# EAGLE design Injector_1.0v_making (EAGLE 6.5.0)
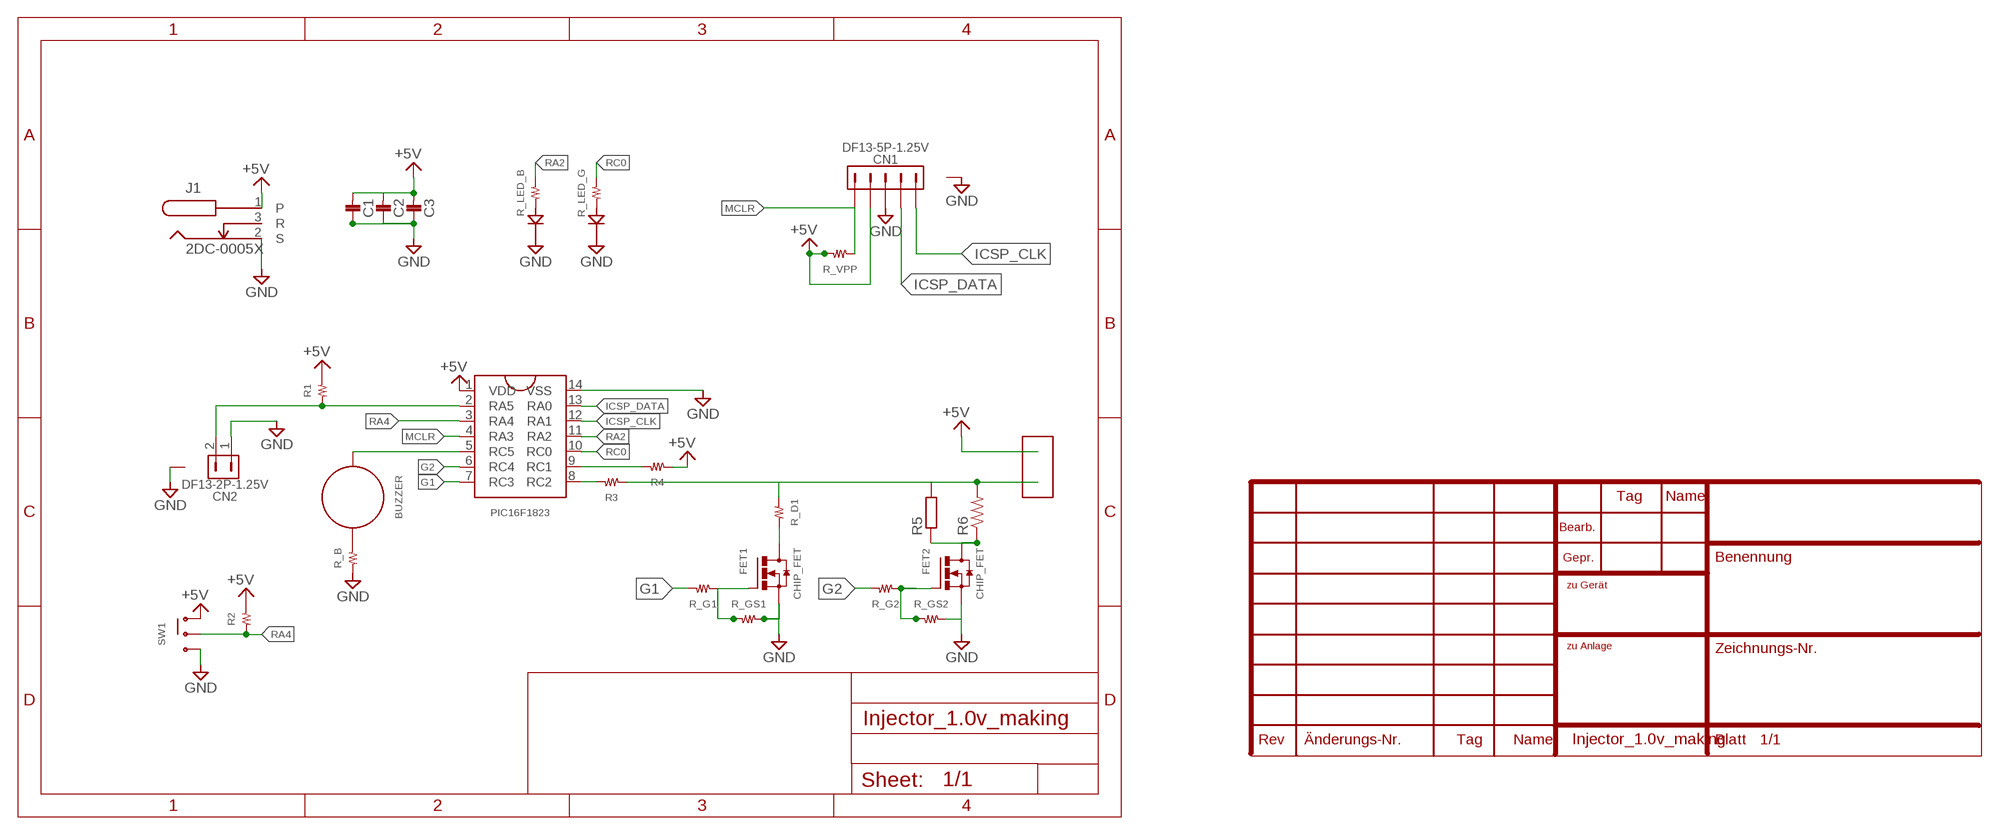
[diagram p0: schematic, sheet 1]

## Parts
BUZZER  PKM13EPYH  [PKM13EPYH]
C1  1608  [1608]
C2  1608  [1608]
C3  3225  [3225]
CN1  DF13-5P-1.25V  [DF13C-5P-1.25V]
CN2  DF13-2P-1.25V  [DF13C-2P-1.25V]
CN3  PIN_HEADER_2  [PIN_HEADER_2S]
FET1  CHIP_FET  [SOT23]
FET2  CHIP_FET  [SOT23]
IC1  PIC16F1823  [TSSOP]
J1  2DC-0005X  [2DC-0005D]
LED_B  CHIPLED  [1608]
LED_G  CHIPLED  [1608]
R1  RESISTOR__SMD  [1608]
R2  RESISTOR__SMD  [1608]
R3  RESISTOR__SMD  [1608]
R4  RESISTOR__SMD  [1608]
R5  R-EU_0411/12  [0411/12]
R6  R-US_0613/15  [P0613/15]
R_B  RESISTOR__SMD  [1608]
R_D1  RESISTOR__SMD  [1608]
R_G1  RESISTOR__SMD  [1608]
R_G2  RESISTOR__SMD  [1608]
R_GS1  RESISTOR__SMD  [1608]
R_GS2  RESISTOR__SMD  [1608]
R_LED_B  RESISTOR__SMD  [1608]
R_LED_G  RESISTOR__SMD  [1608]
R_VPP  RESISTOR__SMD  [1608]
SW1  SSSS213202  [SSSS2]

## Nets
+5V: C1.P$2 C2.P$2 C3.P$2 CN1.P$2 CN3.P$2 IC1.1(VDD) J1.1(P) R1.2 R2.2 R4.1 R_VPP.2 SW1.1 SW1.1-
G1: IC1.7(RC3) R_G1.2
G2: IC1.6(RC4) R_G2.2
GND: C1.P$1 C2.P$1 C3.P$1 CN1.M$0(G) CN1.M$1(G) CN1.P$3 CN1.P$6(G) CN1.P$7(G) CN2.1 CN2.G1(G) CN2.G2(G) CN2.M$0(G) CN2.M$1(G) FET1.2(S) FET2.2(S) IC1.14(VSS) J1.2(S) LED_B.2(K) LED_G.2(K) R_B.1 R_GS1.2 R_GS2.2 SW1.3 SW1.3-
ICSP_CLK: CN1.P$5 IC1.12(RA1)
ICSP_DATA: CN1.P$4 IC1.13(RA0)
MCLR: CN1.P$1 IC1.4(RA3) R_VPP.1
N$1: FET1.1(G) R_G1.1 R_GS1.1
N$2: FET2.1(G) R_G2.1 R_GS2.1
N$3: FET1.3(D) R_D1.2
N$4: FET2.3(D) R5.1 R6.1
N$5: BUZZER.P$1 IC1.5(RC5)
N$6: BUZZER.P$2 R_B.2
N$7: CN2.2 IC1.2(RA5) R1.1
N$8: IC1.8(RC2) R3.2
N$9: IC1.9(RC1) R4.2
N$10: LED_B.1(A) R_LED_B.1
N$11: CN3.P$1 R3.1 R5.2 R6.2 R_D1.1
N$12: LED_G.1(A) R_LED_G.1
RA2: IC1.11(RA2) R_LED_B.2
RA4: IC1.3(RA4) R2.1 SW1.2 SW1.2-
RC0: IC1.10(RC0) R_LED_G.2
Unconnected: J1.3(R)

## Library data of the parts
BUZZER = dsky_parts:PKM13EPYH
C1 C2 = 02_C:1608
C3 = 02_C:3225
CN1 = con-hirose-df13:DF13-5P-1.25: DF13-5P 1.25mm Pitch Miniature Crimping Connector.
CN2 = con-hirose-df13:DF13-2P-1.25: DF13-2P 1.25mm Pitch Miniature Crimping Connector.
CN3 = 08_CONECTOR:PIN_HEADER_2
FET1 FET2 = 06_FET:CHIP_FET
IC1 = 04_IC:PIC16F1823
J1 = marushin:2DC-0005X
LED_B LED_G = 10_LED:CHIPLED
R1-R4 R_B R_D1 R_G1 R_G2 R_GS1 R_GS2 R_LED_B R_LED_G R_VPP = 01_R:RESISTOR__SMD
R5 = rcl:R-EU_: RESISTOR, European symbol
R6 = rcl:R-US_: RESISTOR, American symbol
SW1 = 09_1_switch:SSSS213202

## Board
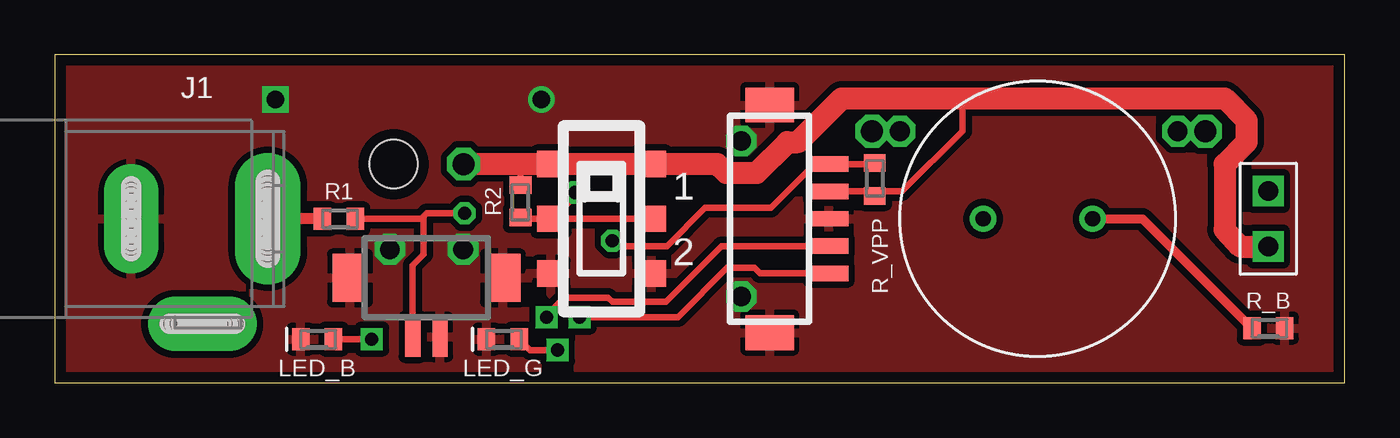
[diagram p1: board, top side]
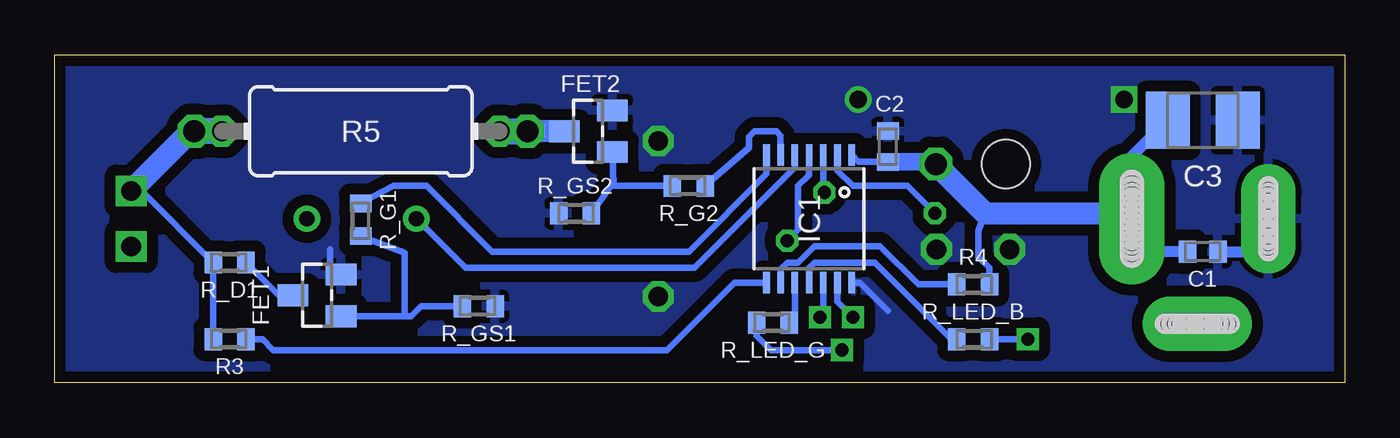
[diagram p2: board, bottom side, seen from below]

Size 59 x 15 mm. Coordinates in mm from the lower left corner, seen from the top.
Outline: 0,0 59,0 59,15 0,15 0,0
Copper layers (1*16): Top 0.035mm / dielectric 1.5mm / Bottom 0.035mm
Design rules "default *": minimum track width 10mil, minimum drill 0.5mm, track to track 8mil, track to pad 8mil, pad to pad 8mil, via to via 8mil, smd to smd 8mil, copper to edge 0.5mm, drill to drill 8mil, minimum pad ring 10mil, minimum via ring 8mil, stop-mask expansion 4mil, vias tented up to drill 0mil, thermal gap 10mil
Holes 2.2 mm at 15.5,10

### Footprints (pad centres in the part's own frame; a part is rotated, then mirrored left to right if it is on the bottom)
PKM13EPYH = drill 0.7: P$1 -2.54,0; P$2 2.46,0
1608 = smd 0.8 x 1: P$1 -0.7,0; P$2 0.7,0
3225 = smd 2 x 2.6: P$1 -1.6,0; P$2 1.6,0
DF13C-5P-1.25V = smd 1.6 x 2.2: M$0 5.2,-1.8; M$1 -5.2,-1.8 | smd 0.7 x 1.8: P$1 -2.5,0.9; P$2 -1.25,0.9; P$3 0,0.9; P$4 1.25,0.9; P$5 2.5,0.9 | drill 0.9 octagon: P$6 -3.55,-3.1; P$7 3.55,-3.1
DF13C-2P-1.25V = smd 0.7 x 1.8: 1 -0.625,0.9; 2 0.625,0.9 | drill 0.9 octagon: G1 -1.675,-3.1; G2 1.675,-3.1 | smd 1.6 x 2.2: M$0 3.5,-1.8; M$1 -3.5,-1.8
PIN_HEADER_2S = drill 0.9 square: P$1 -1.27,0; P$2 1.27,0
SOT23 = smd 1 x 1.4: 1 -0.95,-1.1; 2 0.95,-1.1; 3 0,1.1
TSSOP = smd 0.305 x 0.991: 1 -1.95,-2.918; 2 -1.3,-2.918; 3 -0.65,-2.918; 4 0,-2.918; 5 0.65,-2.918; 6 1.3,-2.918; 7 1.95,-2.918; 8 1.95,2.918; 9 1.3,2.918; 10 0.65,2.918; 11 0,2.918; 12 -0.65,2.918; 13 -1.3,2.918; 14 -1.95,2.918
2DC-0005D = drill 0.8 pad 3 long: 1 6.25,0 | drill 0.8 pad 2.5 long: 2 0,0; 3 3.25,-4.8 | hole 0.8: 0,0.1; 0,0.2; 0,0.3; 0,0.4; 0,0.5; 0,0.6; 0,0.7; 0,0.8; 0,0.9; 0,1; 0,1.1; 0,1.2; 0,1.3; 0,1.4; 0,1.5; 0,-0.1; 0,-0.2; 0,-0.3; 0,-0.4; 0,-0.5; 0,-0.6; 0,-0.7; 0,-0.8; 0,-0.9; 0,-1; 0,-1.1; 0,-1.2; 0,-1.3; 0,-1.4; 0,-1.5; 3.25,-4.8; 3.35,-4.8; 3.45,-4.8; 3.55,-4.8; 3.65,-4.8; 3.75,-4.8; 3.85,-4.8; 3.95,-4.8; 4.05,-4.8; 4.15,-4.8; 4.25,-4.8; 4.35,-4.8; 4.45,-4.8; 4.55,-4.8; 4.65,-4.8; 4.75,-4.8; 3.15,-4.8; 3.05,-4.8; 2.95,-4.8; 2.85,-4.8; 2.75,-4.8; 2.65,-4.8; 2.55,-4.8; 2.45,-4.8; 2.35,-4.8; 2.25,-4.8; 2.15,-4.8; 2.05,-4.8; 1.95,-4.8; 1.85,-4.8; 1.75,-4.8 | hole 1: 6.25,0; 6.25,0.1; 6.25,0.2; 6.25,0.3; 6.25,0.4; 6.25,0.5; 6.25,0.7; 6.25,0.6; 6.25,0.8; 6.25,0.9; 6.25,0.9; 6.25,1; 6.25,1.1; 6.25,1.2; 6.25,1.3; 6.25,1.4; 6.25,1.5; 6.25,1.6; 6.25,1.7; 6.25,-0.1; 6.25,-0.2; 6.25,-0.3; 6.25,-0.4; 6.25,-0.5; 6.25,-0.6; 6.25,-0.7; 6.25,-0.8; 6.25,-0.9; 6.25,-1; 6.25,-1.1; 6.25,-1.2; 6.25,-1.3; 6.25,-1.4; 6.25,-1.5; 6.25,-1.6; 6.25,-1.7
1608' = smd 0.8 x 1: 1 -0.75,0; 2 0.75,0
0411/12 = drill 0.9 octagon: 1 -6.35,0; 2 6.35,0
P0613/15 = drill 1 octagon: 1 -7.62,0; 2 7.62,0
SSSS2 = smd 1.2 x 1.3: 1 -2.5,2.3; 1- -2.5,-2.3; 2 0,2.3; 2- 0,-2.3; 3 2.5,2.3; 3- 2.5,-2.3

### Placement (x,y rotation side)
BUZZER  45,7.5 0 top
C1  6.5,6 180 bottom
C2  20.9,10.8 270 bottom
C3  6.5,12 180 bottom
CN1  34.5,7.5 270 top
CN2  17,3 180 top
CN3  55.5,7.5 270 top
DRILEGEND  [DRILEGEND]  -11.05,-4.01 0 top  (outside the outline)
FET1  47,4 90 bottom
FET2  34.6,11.5 90 bottom
IC1  24.5,7.5 180 bottom
J1  3.5,7.5 0 top
LED_B  CHIPLED  [1608']  12,2 180 top
LED_G  CHIPLED  [1608']  20.5,2 180 top
R1  [1608']  13,7.5 180 top
R2  [1608']  21.3,8.3 90 top
R3  [1608']  51,2 0 bottom
R4  [1608']  17,4.5 180 bottom
R5  45,11.5 180 bottom
R6  45,11.5 180 bottom
R_B  [1608']  55.5,2.5 180 top
R_D1  [1608']  51,5.5 0 bottom
R_G1  [1608']  45,7.45 90 bottom
R_G2  [1608']  30,9 0 bottom
R_GS1  [1608']  39.6,3.5 0 bottom
R_GS2  [1608']  35.2,7.75 180 bottom
R_LED_B  [1608']  17,2 180 bottom
R_LED_G  [1608']  26.15,2.75 0 bottom
R_VPP  [1608']  37.5,9.3 270 top
SW1  25,7.5 270 top

### Tracks (layer width: path | path; a pad name or v marks a point on that pad's centre or on a via)
+5V  (via drill 1)
  Top 0.3: R2.2 21.3,9.7 C2.P$2 18.8,10.1 v18.7,10 | CN1.P$2 37.5,8.75 | 41.5,13 41.5,11.5 38.75,8.75 37.5,8.75 | R_VPP.2 37.5,8.75
  Top 0.5: R1.2 J1.1
  Top 1: v18.7,10 SW1.1- SW1.1 30.3,10 30.7,9.6 32.1,9.6 33.5,11 34,11 36,13 41.5,13 53.5,13 54.5,12 54.5,11 53.5,10 53.5,7 54.23,6.23 CN3.P$2
  Bottom 0.3: IC1.1 22.23,10.1 C2.P$2 | R4.1 16.25,5.25 16.75,5.75 16.75,6.95 16.45,7.75
  Bottom 0.5: C1.P$2 8.75,6 J1.1 9.75,10.35 C3.P$2
  Bottom 0.8: v18.7,10 18.8,10.1 C2.P$2
  Bottom 1: v18.7,10 16.45,7.75 9.75,7.75 J1.1
G1
  Bottom 0.3: IC1.7 26.45,9.55 30,6 39,6 42,9 43.5,9 44.95,8.25 R_G1.2
G2
  Bottom 0.3: IC1.6 25.8,11.3 26,11.5 27,11.5 27.25,11.25 27.25,10.75 R_G2.2
GND  (via drill 0.8)
  Bottom 0.3: FET1.2 46.4,4.95 46.4,6.1 | IC1.14 22.18,4.58 20.9,3.3
  Bottom 0.5: C1.P$1 4.5,6 J1.2
  other vias: 10.1,12.95 22.25,12.95
  pour Bottom (isolate 0.5): 0,15 59,15 59,0 0,0
  pour Top (isolate 0.3): 0,15 59,15 59,0 0,0
ICSP_CLK  (via drill 0.6)
  Top 0.3: v24,3 28.5,3 30.75,5.25 32,5.25 32.25,5 CN1.P$5
  Bottom 0.3: IC1.12 23.85,3.15 v24,3
ICSP_DATA  (via drill 0.6)
  Top 0.3: v22.5,3 22.5,3.1 23.3,3.9 25.3,3.9 25.5,3.7 27.95,3.7 30.5,6.25 33.35,6.25 33.75,6.25 CN1.P$4
  Bottom 0.3: v22.5,3 23.2,3.7 IC1.13
MCLR  (via drill 0.6)
  Top 0.3: R_VPP.1 37.85,10 CN1.P$1 34.75,10 32.75,8 29.75,8 28,6.25 25.75,6.25 v25.5,6.5
  Bottom 0.3: IC1.4 24.5,9.5 25,9 25,7 v25.5,6.5
N$1
  Bottom 0.3: 43,3.05 42.7,3.05 42.25,3.5 R_GS1.1 | FET1.1 43,3.05 | 43,3.05 43,5.95 R_G1.1
N$2
  Bottom 0.3: R_G2.1 33.45,9 | 33.45,9 FET2.1 | 33.45,9 33.55,9 R_GS2.1
N$3
  Bottom 0.3: FET1.3 48.75,4 R_D1.2
N$4
  Bottom 1: FET2.3 R6.1
  Bottom 1.2: R5.1 R6.1
N$5
  Bottom 0.3: BUZZER.P$1 40.21,5.25 29.75,5.25 25.15,9.85 IC1.5
N$6
  Top 0.4: BUZZER.P$2 49.75,7.5 R_B.2
N$7  (via drill 0.6)
  Top 0.3: CN2.2 16.38,5.38 16.88,5.88 16.88,7.62 | v18.75,7.75 17,7.75 16.88,7.62 | 16.88,7.62 16.75,7.5 R1.1
  Bottom 0.3: v18.75,7.75 20,9 22.5,9 23.2,9.7 IC1.2
N$8
  Bottom 0.3: R3.2 49.5,2 49,1.5 31,1.5 27.92,4.58 IC1.8
N$9
  Bottom 0.3: R4.2 19.5,4.5 21.25,6.25 24.25,6.25 25,5.5 25.5,5.5 25.8,5.2 IC1.9
N$10  (via drill 0.6)
  Top 0.3: v14.5,2 LED_B.1
  Bottom 0.3: R_LED_B.1 v14.5,2
N$11
  Bottom 0.3: R3.1 R_D1.1 55.02,8.77 CN3.P$1
  Bottom 1: CN3.P$1 52.77,11.5 R6.2
  Bottom 1.2: R5.2 R6.2
N$12  (via drill 0.6)
  Top 0.3: v23,1.5 21.75,1.5 LED_G.1
  Bottom 0.3: R_LED_G.1 26.9,2.15 26.25,1.5 v23,1.5
RA2
  Bottom 0.3: IC1.11 24.5,5.25 24.25,5.5 21.5,5.5 18,2 R_LED_B.2
RA4  (via drill 0.6)
  Top 0.3: SW1.2- SW1.2 | SW1.2- 21.35,7.5 R2.1 | v23.8,8.7 23.8,8.5 SW1.2-
  Bottom 0.3: IC1.3 23.85,8.65 v23.8,8.7
RC0
  Bottom 0.3: IC1.10 25.15,3 R_LED_G.2

### Text on the board
Measures: A
tDocu: HILLTOP
DrillLegend: LAYER-STACK
DrillLegend_01-16: 01-16
DrillLegend_01-20: 01-20